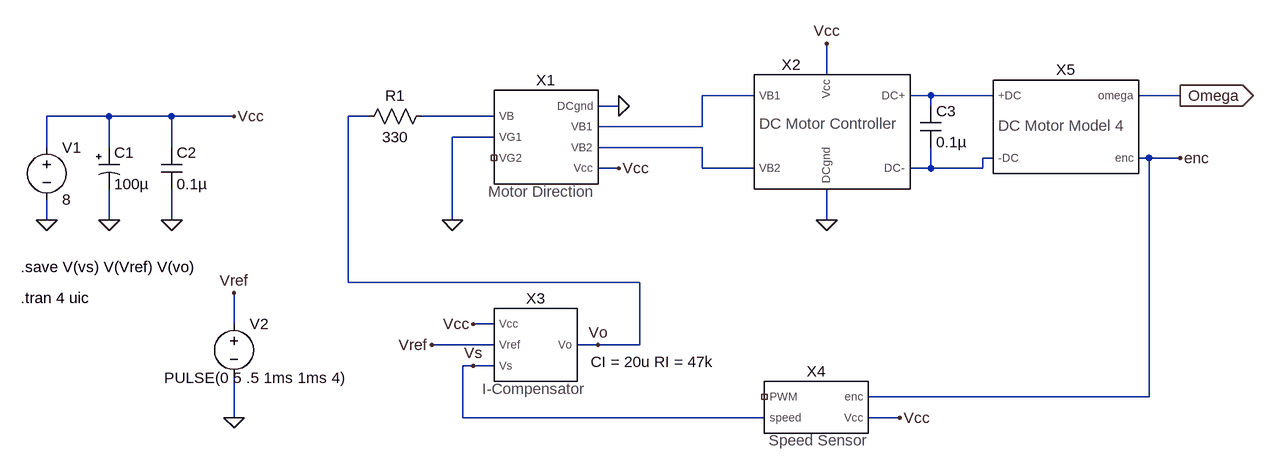
[diagram p0: schematic icomp-closeloop.asc]
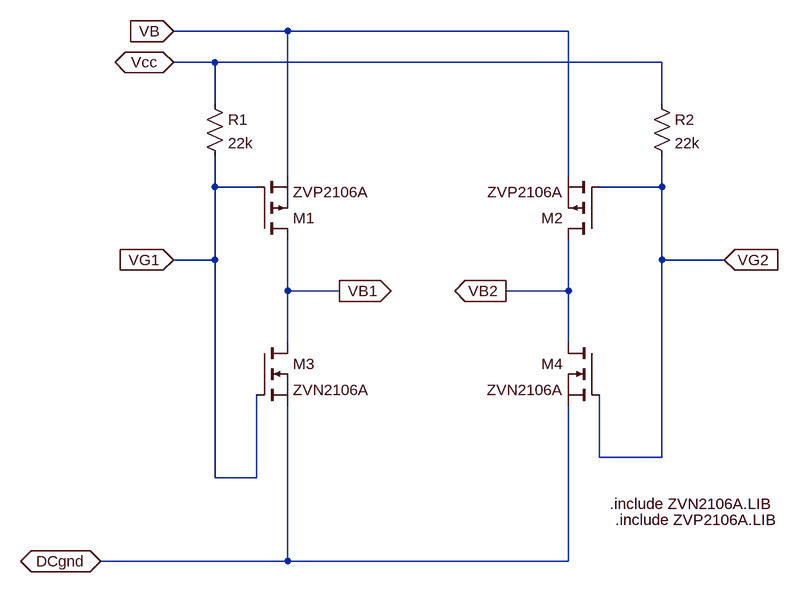
[diagram p1: sub-circuit motor_direction.asc]
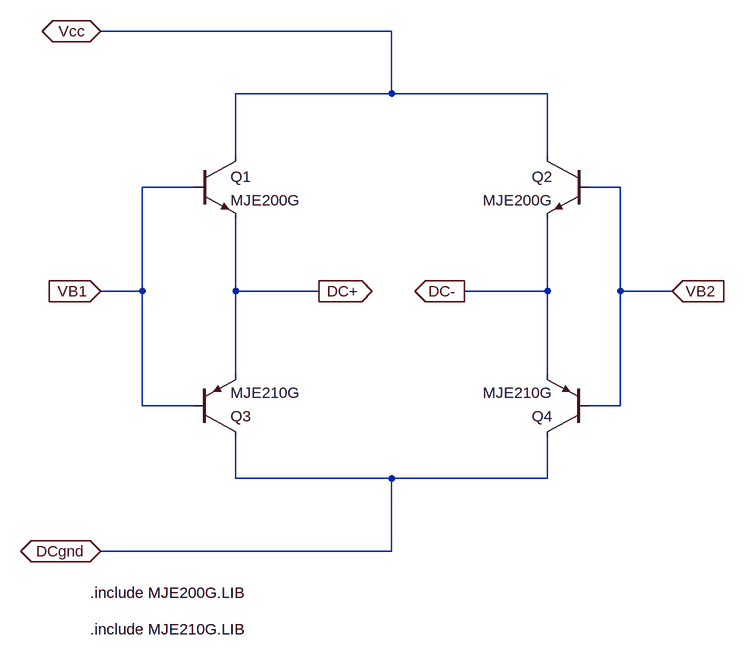
[diagram p2: sub-circuit dc_motor_driver.asc]
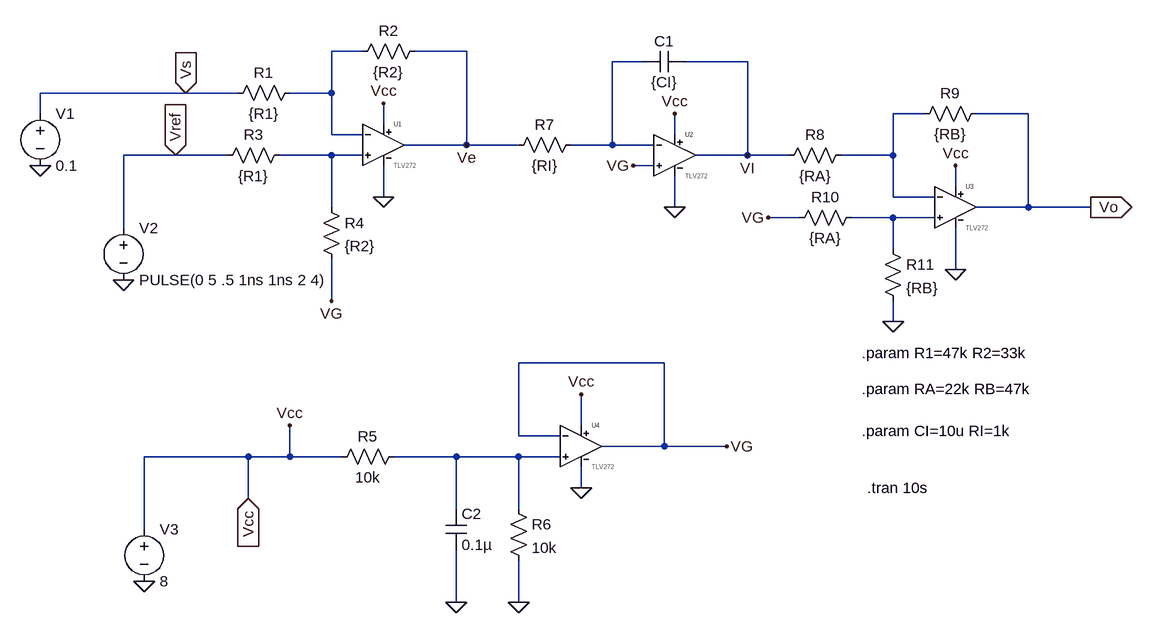
[diagram p3: sub-circuit i-compensator.asc]
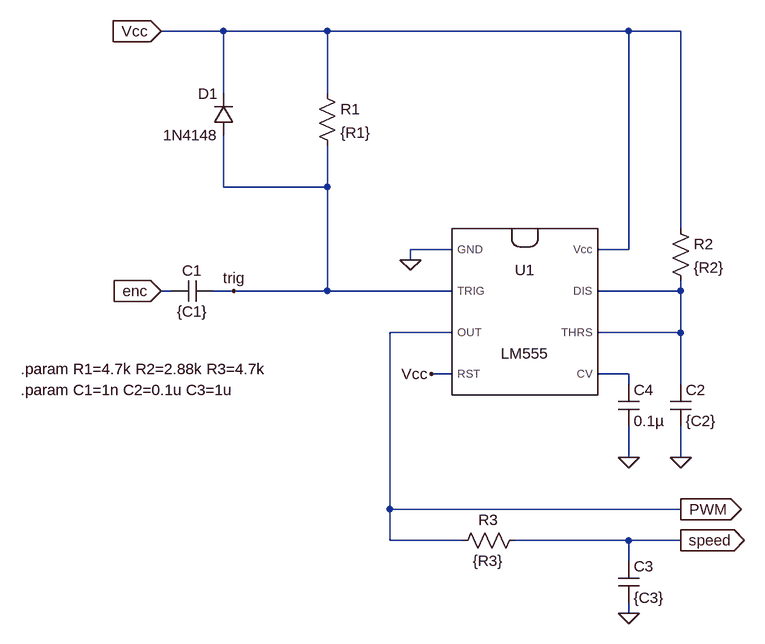
[diagram p4: sub-circuit speed_sensor.asc]
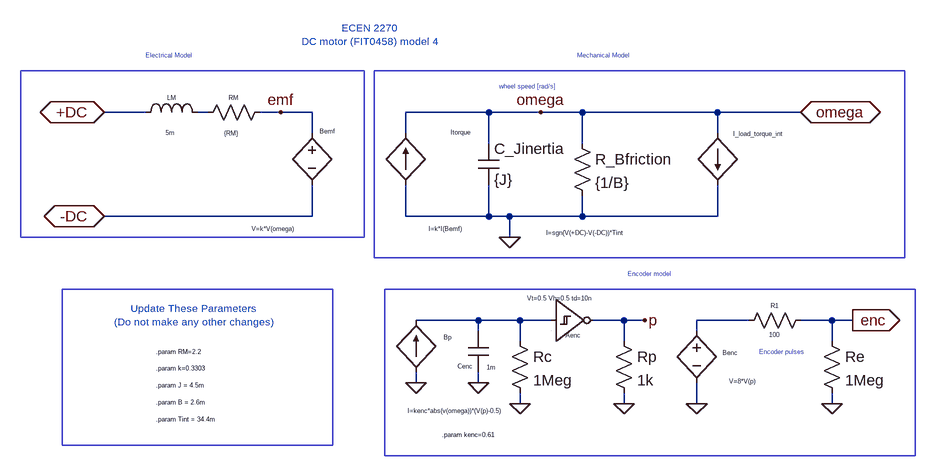
[diagram p5: sub-circuit dc_motor_model4.asc]
icomp-closeloop.asc, the LTspice schematic file:
Version 4
SHEET 1 1804 680
WIRE 1104 -192 1104 -240
WIRE 992 -160 912 -160
WIRE 1264 -160 1232 -160
WIRE 1360 -160 1264 -160
WIRE 1648 -160 1584 -160
WIRE 784 -144 752 -144
WIRE 1264 -144 1264 -160
WIRE 0 -128 -96 -128
WIRE 96 -128 0 -128
WIRE 192 -128 96 -128
WIRE 400 -128 368 -128
WIRE 592 -128 480 -128
WIRE 912 -112 912 -160
WIRE 912 -112 752 -112
WIRE 592 -96 528 -96
WIRE -96 -80 -96 -128
WIRE 0 -80 0 -128
WIRE 96 -80 96 -128
WIRE 912 -80 752 -80
WIRE 1360 -64 1344 -64
WIRE 1600 -64 1584 -64
WIRE 1648 -64 1600 -64
WIRE 784 -48 752 -48
WIRE 912 -48 912 -80
WIRE 992 -48 912 -48
WIRE 1264 -48 1264 -80
WIRE 1264 -48 1232 -48
WIRE 1344 -48 1344 -64
WIRE 1344 -48 1264 -48
WIRE -96 32 -96 0
WIRE 0 32 0 -16
WIRE 96 32 96 -16
WIRE 528 32 528 -96
WIRE 1104 32 1104 -16
WIRE 368 128 368 -128
WIRE 816 128 368 128
WIRE 192 192 192 144
WIRE 592 192 560 192
WIRE 592 224 496 224
WIRE 752 224 720 224
WIRE 816 224 816 128
WIRE 816 224 752 224
WIRE 560 256 544 256
WIRE 592 256 560 256
WIRE 1600 304 1600 -64
WIRE 1600 304 1168 304
WIRE 192 336 192 272
WIRE 544 336 544 256
WIRE 1008 336 544 336
WIRE 1216 336 1168 336
FLAG -96 32 0
FLAG 0 32 0
FLAG 96 32 0
FLAG 192 -128 Vcc
FLAG 528 32 0
FLAG 784 -144 0
FLAG 784 -48 Vcc
FLAG 192 336 0
FLAG 1216 336 Vcc
FLAG 1648 -64 enc
FLAG 1648 -160 Omega
IOPIN 1648 -160 Out
FLAG 1104 -240 Vcc
FLAG 1104 32 0
FLAG 752 224 Vo
FLAG 560 192 Vcc
FLAG 560 256 Vs
FLAG 496 224 Vref
FLAG 192 144 Vref
SYMBOL voltage -96 -96 R0
SYMATTR InstName V1
SYMATTR Value 8
SYMBOL polcap -16 -80 R0
SYMATTR InstName C1
SYMATTR Value 100µ
SYMBOL cap 80 -80 R0
SYMATTR InstName C2
SYMATTR Value 0.1µ
SYMBOL Motor_Direction 672 -96 R0
SYMATTR InstName X1
SYMBOL DC_Motor_Driver 1072 -128 R0
SYMATTR InstName X2
SYMBOL I-Compensator 656 224 R0
WINDOW 39 180 42 Bottom 2
SYMATTR SpiceLine CI = 20u RI = 47k
SYMATTR InstName X3
SYMBOL res 496 -144 R90
WINDOW 0 0 56 VBottom 2
WINDOW 3 32 56 VTop 2
SYMATTR InstName R1
SYMATTR Value 330
SYMBOL voltage 192 176 R0
WINDOW 3 -107 99 Left 2
WINDOW 123 0 0 Left 0
WINDOW 39 0 0 Left 0
SYMATTR Value PULSE(0 5 .5 1ms 1ms 4)
SYMATTR InstName V2
SYMBOL Speed_Sensor 1088 320 M0
SYMATTR InstName X4
SYMBOL DC_motor_model4 1456 -112 R0
SYMATTR InstName X5
SYMBOL cap 1248 -144 R0
SYMATTR InstName C3
SYMATTR Value 0.1µ
TEXT -136 152 Left 2 !.tran 4 uic
TEXT -136 104 Left 2 !.save V(vs) V(Vref) V(vo)

motor_direction.asc, the sub-circuit schematic file:
Version 4
SHEET 1 1016 952
WIRE 240 64 64 64
WIRE 672 64 240 64
WIRE 128 112 64 112
WIRE 816 112 128 112
WIRE 128 176 128 112
WIRE 816 176 816 112
WIRE 240 288 240 64
WIRE 672 288 672 64
WIRE 128 304 128 256
WIRE 192 304 128 304
WIRE 816 304 816 256
WIRE 816 304 720 304
WIRE 128 416 128 304
WIRE 128 416 64 416
WIRE 816 416 816 304
WIRE 912 416 816 416
WIRE 240 464 240 384
WIRE 320 464 240 464
WIRE 672 464 672 384
WIRE 672 464 576 464
WIRE 240 544 240 464
WIRE 672 544 672 464
WIRE 720 720 720 624
WIRE 816 720 816 416
WIRE 816 720 720 720
WIRE 128 752 128 416
WIRE 192 752 192 624
WIRE 192 752 128 752
WIRE 240 880 240 640
WIRE 240 880 -48 880
WIRE 672 880 672 640
WIRE 672 880 240 880
FLAG 64 64 VB
IOPIN 64 64 In
FLAG 64 112 Vcc
IOPIN 64 112 BiDir
FLAG -48 880 DCgnd
IOPIN -48 880 BiDir
FLAG 64 416 VG1
IOPIN 64 416 In
FLAG 912 416 VG2
IOPIN 912 416 In
FLAG 320 464 VB1
IOPIN 320 464 Out
FLAG 576 464 VB2
IOPIN 576 464 Out
SYMBOL res 112 160 R0
SYMATTR InstName R1
SYMATTR Value 22k
SYMBOL pmos 720 384 R180
SYMATTR InstName M2
SYMATTR Value ZVP2106A
SYMBOL pmos 192 384 M180
SYMATTR InstName M1
SYMATTR Value ZVP2106A
SYMBOL nmos 192 544 R0
SYMATTR InstName M3
SYMATTR Value ZVN2106A
SYMBOL nmos 720 544 M0
SYMATTR InstName M4
SYMATTR Value ZVN2106A
SYMBOL res 800 160 R0
SYMATTR InstName R2
SYMATTR Value 22k
TEXT 736 792 Left 2 !.include ZVN2106A.LIB
TEXT 744 816 Left 2 !.include ZVP2106A.LIB

dc_motor_driver.asc, the sub-circuit schematic file:
Version 4
SHEET 1 1272 872
WIRE 128 -336 -320 -336
WIRE 128 -240 128 -336
WIRE 128 -240 -112 -240
WIRE 368 -240 128 -240
WIRE -112 -144 -112 -240
WIRE 368 -144 368 -240
WIRE -176 -96 -256 -96
WIRE 480 -96 432 -96
WIRE -256 64 -256 -96
WIRE -256 64 -320 64
WIRE -112 64 -112 -48
WIRE 16 64 -112 64
WIRE 368 64 368 -48
WIRE 368 64 240 64
WIRE 480 64 480 -96
WIRE 560 64 480 64
WIRE -112 192 -112 64
WIRE 368 192 368 64
WIRE -256 240 -256 64
WIRE -176 240 -256 240
WIRE 480 240 480 64
WIRE 480 240 432 240
WIRE -112 352 -112 288
WIRE 128 352 -112 352
WIRE 368 352 368 288
WIRE 368 352 128 352
WIRE 128 464 128 352
WIRE 128 464 -320 464
FLAG -320 464 DCgnd
IOPIN -320 464 BiDir
FLAG -320 -336 Vcc
IOPIN -320 -336 BiDir
FLAG -320 64 VB1
IOPIN -320 64 In
FLAG 560 64 VB2
IOPIN 560 64 In
FLAG 16 64 DC+
IOPIN 16 64 Out
FLAG 240 64 DC-
IOPIN 240 64 Out
SYMBOL npn -176 -144 R0
SYMATTR InstName Q1
SYMATTR Value MJE200G
SYMBOL pnp -176 288 M180
SYMATTR InstName Q3
SYMATTR Value MJE210G
SYMBOL pnp 432 288 R180
SYMATTR InstName Q4
SYMATTR Value MJE210G
SYMBOL npn 432 -144 M0
SYMATTR InstName Q2
SYMATTR Value MJE200G
TEXT -336 528 Left 2 !.include MJE200G.LIB
TEXT -336 584 Left 2 !.include MJE210G.LIB

i-compensator.asc, the sub-circuit schematic file:
Version 4
SHEET 1 1524 1472
WIRE 176 48 128 48
WIRE 336 48 256 48
WIRE 608 64 560 64
WIRE 768 64 672 64
WIRE -96 112 -320 112
WIRE -16 112 -96 112
WIRE 128 112 128 48
WIRE 128 112 64 112
WIRE -320 144 -320 112
WIRE 1040 144 992 144
WIRE 1200 144 1120 144
WIRE 208 160 208 128
WIRE 128 176 128 112
WIRE 176 176 128 176
WIRE 656 176 656 144
WIRE 336 192 336 48
WIRE 336 192 240 192
WIRE 416 192 336 192
WIRE 560 192 560 64
WIRE 560 192 496 192
WIRE 624 192 560 192
WIRE -112 208 -192 208
WIRE -32 208 -112 208
WIRE 128 208 48 208
WIRE 176 208 128 208
WIRE 768 208 768 64
WIRE 768 208 688 208
WIRE 832 208 768 208
WIRE 992 208 992 144
WIRE 992 208 912 208
WIRE 624 224 592 224
WIRE 1088 256 1088 224
WIRE 208 272 208 224
WIRE 992 272 992 208
WIRE 1056 272 992 272
WIRE 128 288 128 208
WIRE 656 288 656 240
WIRE 1200 288 1200 144
WIRE 1200 288 1120 288
WIRE 1296 288 1200 288
WIRE 848 304 800 304
WIRE 992 304 928 304
WIRE 1056 304 992 304
WIRE -192 320 -192 208
WIRE 992 352 992 304
WIRE 1088 384 1088 320
WIRE 128 432 128 368
WIRE 992 464 992 432
WIRE 640 528 416 528
WIRE 512 624 512 576
WIRE 416 640 416 528
WIRE 480 640 416 640
WIRE 640 656 640 528
WIRE 640 656 544 656
WIRE 736 656 640 656
WIRE 0 672 -160 672
WIRE 64 672 64 624
WIRE 64 672 0 672
WIRE 144 672 64 672
WIRE 320 672 224 672
WIRE 416 672 320 672
WIRE 480 672 416 672
WIRE 512 720 512 688
WIRE 0 736 0 672
WIRE 320 752 320 672
WIRE 416 752 416 672
WIRE -160 784 -160 672
WIRE 320 896 320 816
WIRE 416 896 416 832
FLAG 208 128 Vcc
FLAG 208 272 0
FLAG 592 224 VG
FLAG 656 288 0
FLAG 1088 224 Vcc
FLAG 656 144 Vcc
FLAG 992 464 0
FLAG 800 304 VG
FLAG 1088 384 0
FLAG 320 896 0
FLAG 416 896 0
FLAG 736 656 VG
FLAG 512 576 Vcc
FLAG 64 624 Vcc
FLAG 512 720 0
FLAG 1296 288 Vo
IOPIN 1296 288 Out
FLAG 128 432 VG
FLAG 768 208 VI
FLAG 336 192 Ve
FLAG -112 208 Vref
IOPIN -112 208 In
FLAG -96 112 Vs
IOPIN -96 112 In
FLAG 0 736 Vcc
IOPIN 0 736 In
FLAG -160 864 0
FLAG -192 400 0
FLAG -320 224 0
SYMBOL res 80 96 R90
WINDOW 0 0 56 VBottom 2
WINDOW 3 32 56 VTop 2
SYMATTR InstName R1
SYMATTR Value {R1}
SYMBOL res 272 32 R90
WINDOW 0 0 56 VBottom 2
WINDOW 3 32 56 VTop 2
SYMATTR InstName R2
SYMATTR Value {R2}
SYMBOL TLV272 208 192 R0
SYMATTR InstName U1
SYMBOL res 512 176 R90
WINDOW 0 0 56 VBottom 2
WINDOW 3 32 56 VTop 2
SYMATTR InstName R7
SYMATTR Value {RI}
SYMBOL cap 672 48 R90
WINDOW 0 0 32 VBottom 2
WINDOW 3 32 32 VTop 2
SYMATTR InstName C1
SYMATTR Value {CI}
SYMBOL TLV272 656 208 R0
SYMATTR InstName U2
SYMBOL res 928 192 R90
WINDOW 0 0 56 VBottom 2
WINDOW 3 32 56 VTop 2
SYMATTR InstName R8
SYMATTR Value {RA}
SYMBOL res 1136 128 R90
WINDOW 0 0 56 VBottom 2
WINDOW 3 32 56 VTop 2
SYMATTR InstName R9
SYMATTR Value {RB}
SYMBOL TLV272 1088 288 R0
SYMATTR InstName U3
SYMBOL res 976 336 R0
SYMATTR InstName R11
SYMATTR Value {RB}
SYMBOL res 944 288 R90
WINDOW 0 0 56 VBottom 2
WINDOW 3 32 56 VTop 2
SYMATTR InstName R10
SYMATTR Value {RA}
SYMBOL res 240 656 R90
WINDOW 0 0 56 VBottom 2
WINDOW 3 32 56 VTop 2
SYMATTR InstName R5
SYMATTR Value 10k
SYMBOL cap 304 752 R0
SYMATTR InstName C2
SYMATTR Value 0.1µ
SYMBOL res 400 736 R0
SYMATTR InstName R6
SYMATTR Value 10k
SYMBOL TLV272 512 656 R0
SYMATTR InstName U4
SYMBOL res 64 192 R90
WINDOW 0 0 56 VBottom 2
WINDOW 3 32 56 VTop 2
SYMATTR InstName R3
SYMATTR Value {R1}
SYMBOL res 112 272 R0
SYMATTR InstName R4
SYMATTR Value {R2}
SYMBOL voltage -320 128 R0
WINDOW 123 0 0 Left 0
WINDOW 39 24 124 Left 2
SYMATTR InstName V1
SYMATTR Value 0.1
SYMBOL voltage -192 304 R0
WINDOW 123 0 0 Left 0
WINDOW 39 0 0 Left 0
SYMATTR InstName V2
SYMATTR Value PULSE(0 5 .5 1ns 1ns 2 4)
SYMBOL voltage -160 768 R0
WINDOW 123 0 0 Left 0
WINDOW 39 0 0 Left 0
SYMATTR InstName V3
SYMATTR Value 8
TEXT 944 512 Left 2 !.param R1=47k R2=33k
TEXT 944 568 Left 2 !.param RA=22k RB=47k
TEXT 944 632 Left 2 !.param CI=10u RI=1k
TEXT 952 720 Left 2 !.tran 10s

speed_sensor.asc, the sub-circuit schematic file:
Version 4
SHEET 1 1416 936
WIRE 560 0 464 0
WIRE 720 0 560 0
WIRE 1184 0 720 0
WIRE 1264 0 1184 0
WIRE 560 96 560 0
WIRE 720 96 720 0
WIRE 560 240 560 160
WIRE 720 240 720 176
WIRE 720 240 560 240
WIRE 1264 304 1264 0
WIRE 912 336 848 336
WIRE 1184 336 1184 0
WIRE 1184 336 1136 336
WIRE 848 352 848 336
WIRE 480 400 464 400
WIRE 576 400 544 400
WIRE 720 400 720 240
WIRE 720 400 576 400
WIRE 912 400 720 400
WIRE 1264 400 1264 384
WIRE 1264 400 1136 400
WIRE 912 464 816 464
WIRE 1264 464 1264 400
WIRE 1264 464 1136 464
WIRE 912 528 880 528
WIRE 1184 528 1136 528
WIRE 1184 544 1184 528
WIRE 1264 544 1264 464
WIRE 1184 656 1184 608
WIRE 1264 656 1264 608
WIRE 816 736 816 464
WIRE 1264 736 816 736
WIRE 816 784 816 736
WIRE 928 784 816 784
WIRE 1184 784 1008 784
WIRE 1264 784 1184 784
WIRE 1184 816 1184 784
WIRE 1184 896 1184 880
FLAG 848 352 0
FLAG 880 528 Vcc
FLAG 576 400 trig
FLAG 1184 896 0
FLAG 1184 656 0
FLAG 1264 656 0
FLAG 1264 736 PWM
IOPIN 1264 736 Out
FLAG 1264 784 speed
IOPIN 1264 784 Out
FLAG 464 0 Vcc
IOPIN 464 0 In
FLAG 464 400 enc
IOPIN 464 400 In
SYMBOL cap 544 384 R90
WINDOW 0 0 32 VBottom 2
WINDOW 3 32 32 VTop 2
SYMATTR InstName C1
SYMATTR Value {C1}
SYMBOL res 704 80 R0
SYMATTR InstName R1
SYMATTR Value {R1}
SYMBOL diode 576 160 R180
WINDOW 0 24 64 Left 2
WINDOW 3 24 0 Left 2
SYMATTR InstName D1
SYMATTR Value 1N4148
SYMBOL LM555 1024 432 R0
SYMATTR InstName U1
SYMBOL res 1248 288 R0
SYMATTR InstName R2
SYMATTR Value {R2}
SYMBOL cap 1248 544 R0
SYMATTR InstName C2
SYMATTR Value {C2}
SYMBOL res 1024 768 R90
WINDOW 0 0 56 VBottom 2
WINDOW 3 32 56 VTop 2
SYMATTR InstName R3
SYMATTR Value {R3}
SYMBOL cap 1168 816 R0
SYMATTR InstName C3
SYMATTR Value {C3}
SYMBOL cap 1168 544 R0
SYMATTR InstName C4
SYMATTR Value 0.1µ
TEXT 248 520 Left 2 !.param R1=4.7k R2=2.88k R3=4.7k
TEXT 248 552 Left 2 !.param C1=1n C2=0.1u C3=1u

dc_motor_model4.asc, the sub-circuit schematic file:
Version 4
SHEET 1 880 680
WIRE -528 -176 -592 -176
WIRE -432 -176 -448 -176
WIRE -320 -176 -352 -176
WIRE -272 -176 -320 -176
WIRE 0 -176 -128 -176
WIRE 80 -176 0 -176
WIRE 144 -176 80 -176
WIRE 352 -176 144 -176
WIRE 480 -176 352 -176
WIRE -272 -144 -272 -176
WIRE -128 -144 -128 -176
WIRE 352 -144 352 -176
WIRE 0 -128 0 -176
WIRE 144 -128 144 -176
WIRE -272 -16 -272 -64
WIRE -272 -16 -592 -16
WIRE -128 -16 -128 -64
WIRE 0 -16 0 -64
WIRE 0 -16 -128 -16
WIRE 32 -16 0 -16
WIRE 144 -16 144 -48
WIRE 144 -16 32 -16
WIRE 352 -16 352 -64
WIRE 352 -16 144 -16
WIRE 32 16 32 -16
WIRE -16 144 -112 144
WIRE 48 144 -16 144
WIRE 96 144 48 144
WIRE 208 144 160 144
WIRE 240 144 208 144
WIRE 400 144 320 144
WIRE 528 144 480 144
WIRE 560 144 528 144
WIRE -16 160 -16 144
WIRE 320 160 320 144
WIRE 48 176 48 144
WIRE 208 176 208 144
WIRE 528 176 528 144
WIRE -112 240 -112 224
WIRE -16 240 -16 224
WIRE 48 272 48 256
WIRE 208 272 208 256
WIRE 320 272 320 240
WIRE 528 272 528 256
FLAG 560 144 enc
IOPIN 560 144 Out
FLAG -112 240 0
FLAG -16 240 0
FLAG 80 -176 omega
FLAG -320 -176 emf
FLAG 240 144 p
FLAG 320 272 0
FLAG -592 -176 +DC
IOPIN -592 -176 BiDir
FLAG -592 -16 -DC
IOPIN -592 -16 BiDir
FLAG 480 -176 omega
IOPIN 480 -176 BiDir
FLAG 32 16 0
FLAG 208 272 0
FLAG 48 272 0
FLAG 528 272 0
SYMBOL Digital\\schmtinv 96 80 R0
WINDOW 3 -37 30 Left 0
WINDOW 0 22 87 Left 0
SYMATTR Value Vt=0.5 Vh=0.5 td=10n
SYMATTR InstName Aenc
SYMBOL bi -112 224 R180
WINDOW 0 -55 54 Left 0
WINDOW 3 -134 -59 Left 0
SYMATTR InstName Bp
SYMATTR Value I=kenc*abs(v(omega))*(V(p)-0.5)
SYMBOL cap -32 160 R0
WINDOW 0 -16 55 Left 0
WINDOW 3 29 56 Left 0
SYMATTR InstName Cenc
SYMATTR Value 1m
SYMBOL ind -544 -160 R270
WINDOW 0 32 56 VTop 0
WINDOW 3 -9 54 VBottom 0
SYMATTR InstName LM
SYMATTR Value 5m
SYMBOL res -448 -160 R270
WINDOW 0 32 56 VTop 0
WINDOW 3 -10 52 VBottom 0
SYMATTR InstName RM
SYMATTR Value {RM}
SYMBOL bv -272 -160 R0
WINDOW 0 12 13 Left 0
WINDOW 3 -93 163 Left 0
SYMATTR InstName Bemf
SYMATTR Value V=k*V(omega)
SYMBOL bi -128 -64 R180
WINDOW 0 -101 81 Left 0
WINDOW 3 -86 -67 Left 0
SYMATTR InstName Itorque
SYMATTR Value I=k*I(Bemf)
SYMBOL cap -16 -128 R0
SYMATTR InstName C_Jinertia
SYMATTR Value {J}
SYMBOL res 128 -144 R0
SYMATTR InstName R_Bfriction
SYMATTR Value {1/B}
SYMBOL bv 320 144 R0
WINDOW 0 40 50 Left 0
WINDOW 3 50 94 Left 0
SYMATTR InstName Benc
SYMATTR Value V=8*V(p)
SYMBOL bi 352 -144 R0
WINDOW 3 -264 153 Left 0
WINDOW 0 24 1 Left 0
SYMATTR Value I=sgn(V(+DC)-V(-DC))*Tint
SYMATTR InstName I_load_torque_int
SYMBOL res 496 128 R90
WINDOW 0 0 56 VBottom 0
WINDOW 3 32 56 VTop 0
SYMATTR InstName R1
SYMATTR Value 100
SYMBOL res 192 160 R0
SYMATTR InstName Rp
SYMATTR Value 1k
SYMBOL res 32 160 R0
SYMATTR InstName Rc
SYMATTR Value 1Meg
SYMBOL res 512 160 R0
SYMATTR InstName Re
SYMATTR Value 1Meg
TEXT -72 320 Left 0 !.param kenc=0.61
TEXT -184 -296 Center 1 ;ECEN 2270\nDC motor (FIT0458) model 4
TEXT 16 -216 Left 0 ;wheel speed [rad/s]
TEXT 416 192 Left 0 ;Encoder pulses
TEXT 248 72 Center 0 ;Encoder model
TEXT -512 192 Left 0 !.param RM=2.2\n \n.param k=0.3303\n \n.param J = 4.5m\n \n.param B = 2.6m\n \n.param Tint = 34.4m
TEXT -456 136 Center 1 ;Update These Parameters\n(Do not make any other changes)
TEXT -528 -264 Left 0 ;Electrical Model
TEXT 136 -264 Left 0 ;Mechanical Model
RECTANGLE Normal -240 336 -656 96
RECTANGLE Normal -192 16 -720 -240
RECTANGLE Normal 640 48 -176 -240
RECTANGLE Normal 656 352 -160 96

The netlist it stands for:
* icomp-closeloop.asc
V1 Vcc 0 8
C1 Vcc 0 100µ
C2 Vcc 0 0.1µ
XX1 N003 0 NC_01 0 N001 N004 Vcc motor_direction
XX2 N001 N004 N002 N005 0 Vcc dc_motor_driver
XX3 Vcc Vref Vs Vo i-compensator params: CI = 20u RI = 47k
R1 N003 Vo 330
V2 Vref 0 PULSE(0 5 .5 1ms 1ms 4)
XX4 enc Vcc NC_02 Vs speed_sensor
XX5 N002 N005 enc Omega dc_motor_model4
C3 N002 N005 0.1µ

* block symbol definitions
.subckt motor_direction VB VG1 VG2 DCgnd VB1 VB2 Vcc
R1 Vcc VG1 22k
M2 VB2 VG2 VB VB ZVP2106A
M1 VB1 VG1 VB VB ZVP2106A
M3 VB1 VG1 DCgnd DCgnd ZVN2106A
M4 VB2 VG2 DCgnd DCgnd ZVN2106A
R2 Vcc VG2 22k
.include ZVN2106A.LIB
.include ZVP2106A.LIB
.ends motor_direction

.subckt dc_motor_driver VB1 VB2 DC+ DC- DCgnd Vcc
Q1 Vcc VB1 DC+ 0 MJE200G
Q3 DCgnd VB1 DC+ 0 MJE210G
Q4 DCgnd VB2 DC- 0 MJE210G
Q2 Vcc VB2 DC- 0 MJE200G
.include MJE200G.LIB
.include MJE210G.LIB
.ends dc_motor_driver

.subckt i-compensator Vcc Vref Vs Vo
R1 N001 Vs {R1}
R2 Ve N001 {R2}
XU1 N004 N001 Vcc 0 Ve level.2 Avol=1Meg GBW=3Meg Slew=2.4Meg ilimit=20m rail=0.1 Vos=0 phimargin=45 en=0 enk=0 in=0 ink=0 Rin=500Meg  ; pins In+ In- V+ V- OUT
R7 N002 Ve {RI}
C1 VI N002 {CI}
XU2 VG N002 Vcc 0 VI level.2 Avol=1Meg GBW=3Meg Slew=2.4Meg ilimit=20m rail=0.1 Vos=0 phimargin=45 en=0 enk=0 in=0 ink=0 Rin=500Meg  ; pins In+ In- V+ V- OUT
R8 N003 VI {RA}
R9 Vo N003 {RB}
XU3 N005 N003 Vcc 0 Vo level.2 Avol=1Meg GBW=3Meg Slew=2.4Meg ilimit=20m rail=0.1 Vos=0 phimargin=45 en=0 enk=0 in=0 ink=0 Rin=500Meg  ; pins In+ In- V+ V- OUT
R11 N005 0 {RB}
R10 N005 VG {RA}
R5 N006 Vcc 10k
C2 N006 0 0.1µ
R6 N006 0 10k
XU4 N006 VG Vcc 0 VG level.2 Avol=1Meg GBW=3Meg Slew=2.4Meg ilimit=20m rail=0.1 Vos=0 phimargin=45 en=0 enk=0 in=0 ink=0 Rin=500Meg  ; pins In+ In- V+ V- OUT
R3 N004 Vref {R1}
R4 N004 VG {R2}
V1 Vs 0 0.1
V2 Vref 0 PULSE(0 5 .5 1ns 1ns 2 4)
V3 Vcc 0 8
.param R1=47k R2=33k
.param RA=22k RB=47k
.param CI=10u RI=1k
.tran 10s
.ends i-compensator

.subckt speed_sensor enc Vcc PWM speed
C1 trig enc {C1}
R1 Vcc trig {R1}
D1 trig Vcc 1N4148
XU1 0 trig PWM Vcc N002 N001 N001 Vcc NE555  ; pins GND TRIG OUT RST CV THRS DIS Vcc
R2 Vcc N001 {R2}
C2 N001 0 {C2}
R3 speed PWM {R3}
C3 speed 0 {C3}
C4 N002 0 0.1µ
.param R1=4.7k R2=2.88k R3=4.7k
.param C1=1n C2=0.1u C3=1u
.ends speed_sensor

.subckt dc_motor_model4 +DC -DC enc omega
Aenc N002 0 0 0 0 p 0 0 SCHMITT Vt=0.5 Vh=0.5 td=10n
Bp 0 N002 I=kenc*abs(v(omega))*(V(p)-0.5)
Cenc N002 0 1m
LM +DC N001 5m
RM N001 emf {RM}
Bemf emf -DC V=k*V(omega)
B§Itorque 0 omega I=k*I(Bemf)
C_Jinertia omega 0 {J}
R_Bfriction omega 0 {1/B}
Benc N003 0 V=8*V(p)
B§I_load_torque_int omega 0 I=sgn(V(+DC)-V(-DC))*Tint
R1 enc N003 100
Rp p 0 1k
Rc N002 0 1Meg
Re enc 0 1Meg
.param kenc=0.61
* ECEN 2270
* DC motor (FIT0458) model 4
* wheel speed [rad/s]
* Encoder pulses
* Encoder model
.param RM=2.2
.param k=0.3303
.param J = 4.5m
.param B = 2.6m
.param Tint = 34.4m
* Update These Parameters
* (Do not make any other changes)
* Electrical Model
* Mechanical Model
.ends dc_motor_model4

.model D D
.lib standard.dio
.model NPN NPN
.model PNP PNP
.lib standard.bjt
.model NMOS NMOS
.model PMOS PMOS
.lib standard.mos
.tran 4 uic
.save V(vs) V(Vref) V(vo)
.lib UniversalOpamps2.sub
.lib NE555.sub
.backanno
.end